# EAGLE design 18650 Battery Tray (EAGLE 9.2.1)
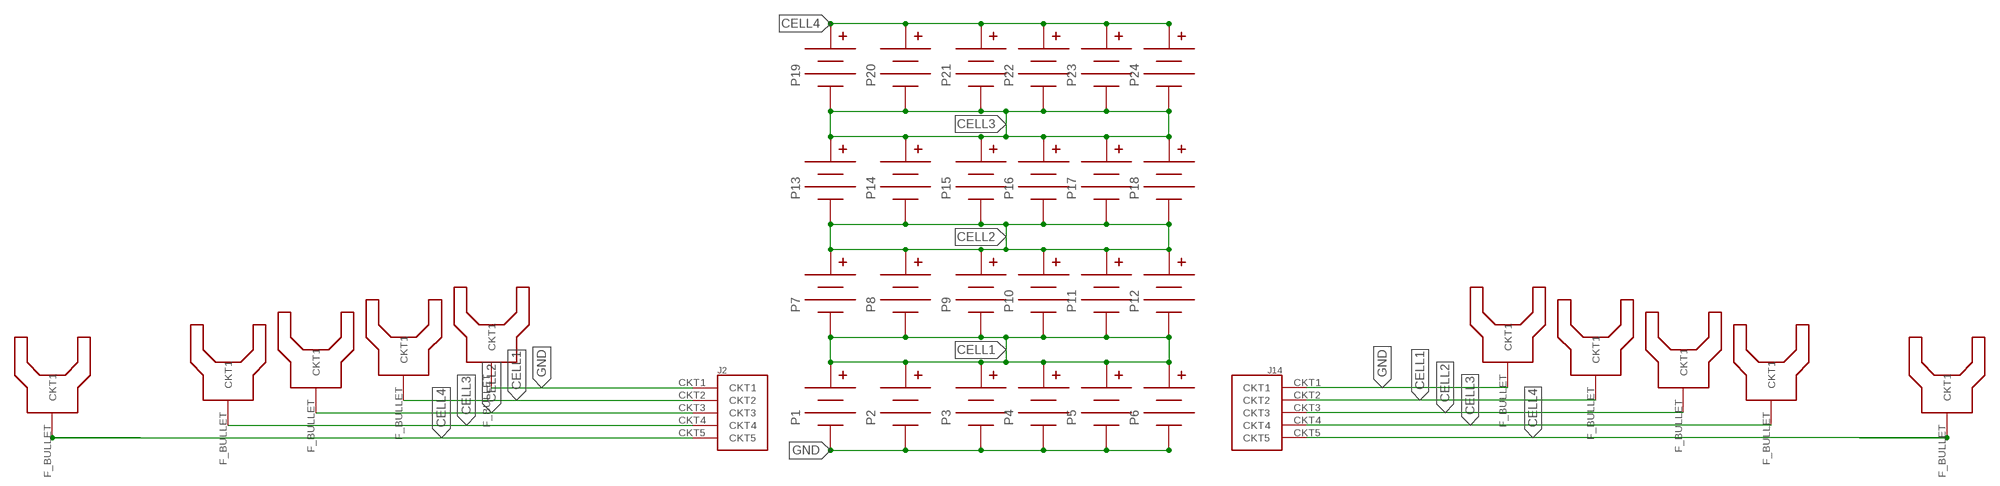
[diagram p0: schematic, sheet 1]

## Parts
J1  FEMALE_BULLET  [FEMALE_BULLET_CONNECTOR_6MM]
J2  MOLEX_NANO_FIT_5CT_VERTICAL_HEADER  [MOLEX_NANO_FIT_5_VERTICAL_HEADER]
J3  FEMALE_BULLET  [FEMALE_BULLET_CONNECTOR_6MM]
J4  FEMALE_BULLET  [FEMALE_BULLET_CONNECTOR_6MM]
J5  FEMALE_BULLET  [FEMALE_BULLET_CONNECTOR_6MM]
J7  FEMALE_BULLET  [FEMALE_BULLET_CONNECTOR_6MM]
J9  FEMALE_BULLET  [FEMALE_BULLET_CONNECTOR_6MM]
J10  FEMALE_BULLET  [FEMALE_BULLET_CONNECTOR_6MM]
J11  FEMALE_BULLET  [FEMALE_BULLET_CONNECTOR_6MM]
J12  FEMALE_BULLET  [FEMALE_BULLET_CONNECTOR_6MM]
J14  MOLEX_NANO_FIT_5CT_VERTICAL_HEADER  [MOLEX_NANO_FIT_5_VERTICAL_HEADER]
J15  FEMALE_BULLET  [FEMALE_BULLET_CONNECTOR_6MM]
P1  18650_BAT_TRAY_SMD_NON_POLAR  [18650_BAT_TRAY_SMD_NON_POLAR]
P2  18650_BAT_TRAY_SMD_NON_POLAR  [18650_BAT_TRAY_SMD_NON_POLAR]
P3  18650_BAT_TRAY_SMD_NON_POLAR  [18650_BAT_TRAY_SMD_NON_POLAR]
P4  18650_BAT_TRAY_SMD_NON_POLAR  [18650_BAT_TRAY_SMD_NON_POLAR]
P5  18650_BAT_TRAY_SMD_NON_POLAR  [18650_BAT_TRAY_SMD_NON_POLAR]
P6  18650_BAT_TRAY_SMD_NON_POLAR  [18650_BAT_TRAY_SMD_NON_POLAR]
P7  18650_BAT_TRAY_SMD_NON_POLAR  [18650_BAT_TRAY_SMD_NON_POLAR]
P8  18650_BAT_TRAY_SMD_NON_POLAR  [18650_BAT_TRAY_SMD_NON_POLAR]
P9  18650_BAT_TRAY_SMD_NON_POLAR  [18650_BAT_TRAY_SMD_NON_POLAR]
P10  18650_BAT_TRAY_SMD_NON_POLAR  [18650_BAT_TRAY_SMD_NON_POLAR]
P11  18650_BAT_TRAY_SMD_NON_POLAR  [18650_BAT_TRAY_SMD_NON_POLAR]
P12  18650_BAT_TRAY_SMD_NON_POLAR  [18650_BAT_TRAY_SMD_NON_POLAR]
P13  18650_BAT_TRAY_SMD_NON_POLAR  [18650_BAT_TRAY_SMD_NON_POLAR]
P14  18650_BAT_TRAY_SMD_NON_POLAR  [18650_BAT_TRAY_SMD_NON_POLAR]
P15  18650_BAT_TRAY_SMD_NON_POLAR  [18650_BAT_TRAY_SMD_NON_POLAR]
P16  18650_BAT_TRAY_SMD_NON_POLAR  [18650_BAT_TRAY_SMD_NON_POLAR]
P17  18650_BAT_TRAY_SMD_NON_POLAR  [18650_BAT_TRAY_SMD_NON_POLAR]
P18  18650_BAT_TRAY_SMD_NON_POLAR  [18650_BAT_TRAY_SMD_NON_POLAR]
P19  18650_BAT_TRAY_SMD_NON_POLAR  [18650_BAT_TRAY_SMD_NON_POLAR]
P20  18650_BAT_TRAY_SMD_NON_POLAR  [18650_BAT_TRAY_SMD_NON_POLAR]
P21  18650_BAT_TRAY_SMD_NON_POLAR  [18650_BAT_TRAY_SMD_NON_POLAR]
P22  18650_BAT_TRAY_SMD_NON_POLAR  [18650_BAT_TRAY_SMD_NON_POLAR]
P23  18650_BAT_TRAY_SMD_NON_POLAR  [18650_BAT_TRAY_SMD_NON_POLAR]
P24  18650_BAT_TRAY_SMD_NON_POLAR  [18650_BAT_TRAY_SMD_NON_POLAR]

## Nets
CELL1: J2.CKT2 J3.F_BULLET(CKT1) J10.F_BULLET(CKT1) J14.CKT2 P1.P$2(V+) P2.P$2(V+) P3.P$2(V+) P4.P$2(V+) P5.P$2(V+) P6.P$2(V+) P7.P$1(V-) P8.P$1(V-) P9.P$1(V-) P10.P$1(V-) P11.P$1(V-) P12.P$1(V-)
CELL2: J2.CKT3 J4.F_BULLET(CKT1) J11.F_BULLET(CKT1) J14.CKT3 P7.P$2(V+) P8.P$2(V+) P9.P$2(V+) P10.P$2(V+) P11.P$2(V+) P12.P$2(V+) P13.P$1(V-) P14.P$1(V-) P15.P$1(V-) P16.P$1(V-) P17.P$1(V-) P18.P$1(V-)
CELL3: J2.CKT4 J5.F_BULLET(CKT1) J12.F_BULLET(CKT1) J14.CKT4 P13.P$2(V+) P14.P$2(V+) P15.P$2(V+) P16.P$2(V+) P17.P$2(V+) P18.P$2(V+) P19.P$1(V-) P20.P$1(V-) P21.P$1(V-) P22.P$1(V-) P23.P$1(V-) P24.P$1(V-)
CELL4: J2.CKT5 J7.F_BULLET(CKT1) J14.CKT5 J15.F_BULLET(CKT1) P19.P$2(V+) P20.P$2(V+) P21.P$2(V+) P22.P$2(V+) P23.P$2(V+) P24.P$2(V+)
GND: J1.F_BULLET(CKT1) J2.CKT1 J9.F_BULLET(CKT1) J14.CKT1 P1.P$1(V-) P2.P$1(V-) P3.P$1(V-) P4.P$1(V-) P5.P$1(V-) P6.P$1(V-)

## Library data of the parts
J1 J3-J5 J7 J9-J12 J15 = Hydronalix:FEMALE_BULLET
J2 J14 = Hydronalix:MOLEX_NANO_FIT_5CT_VERTICAL_HEADER
P1-P24 = Hydronalix:18650_BAT_TRAY_SMD_NON_POLAR

## Board
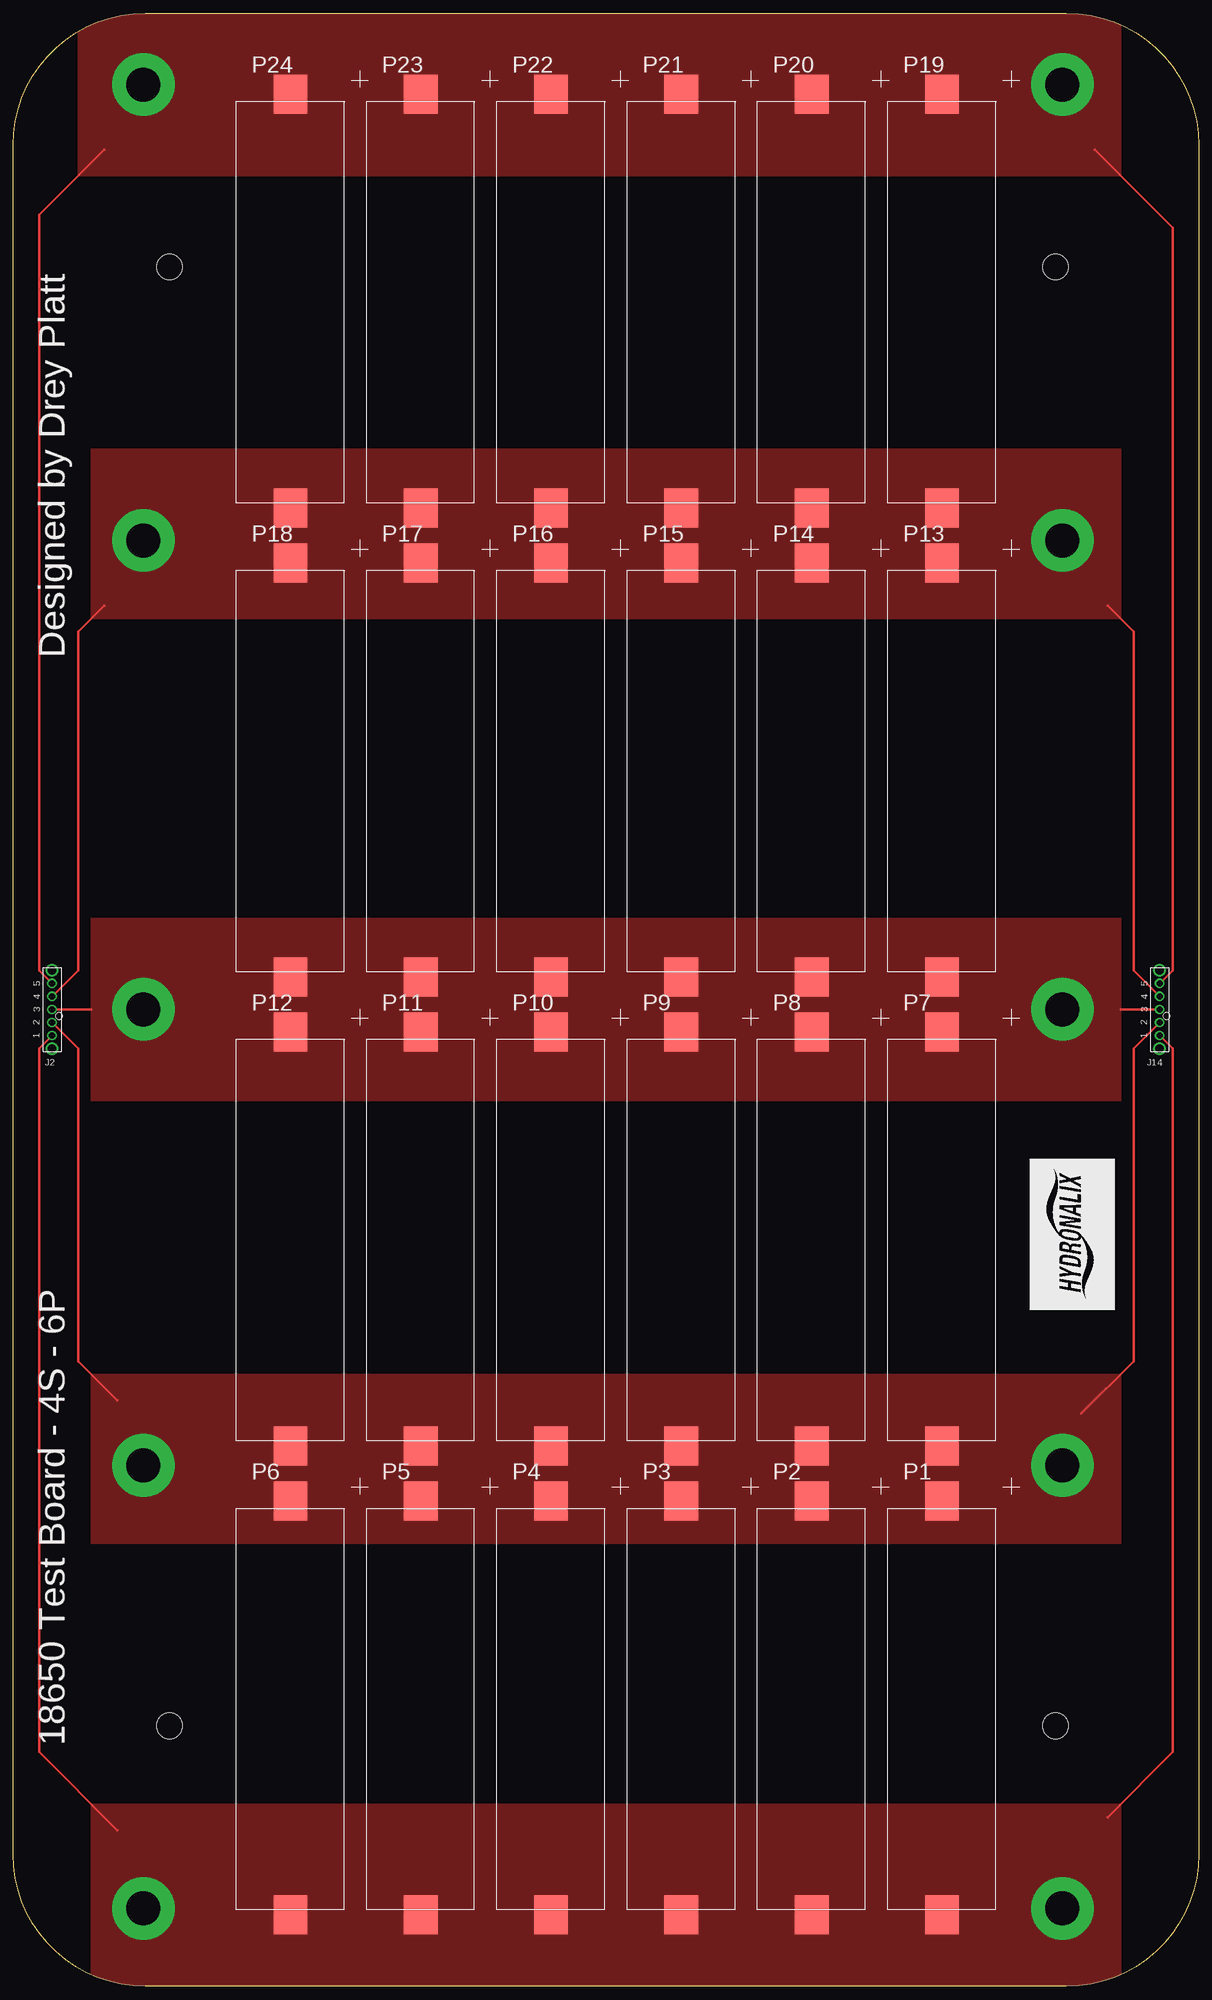
[diagram p1: board, top side]

Size 227.5 x 378.73 mm. Coordinates in mm from the lower left corner, seen from the top.
Outline: 227.5,353.33 227.5,25.4 arc-90 202.1,0 25.4,0 arc-90 0,25.4 0,353.33 arc-90 25.4,378.73 202.1,378.73 arc-90 227.5,353.33
Copper layers (1*16): Top 0.035mm / dielectric 1.5mm / Bottom 0.035mm
Design rules "default *": minimum track width 6mil, minimum drill 0.35mm, track to track 6mil, track to pad 6mil, pad to pad 6mil, via to via 6mil, smd to smd 6mil, copper to edge 6mil, drill to drill 6mil, minimum pad ring 10mil, minimum via ring 8mil, stop-mask expansion 4mil, vias tented up to drill 0mil, thermal gap 0mil
Holes 4.98 mm at 30,50 200,50 200,330 30,330

### Footprints (pad centres in the part's own frame; a part is rotated, then mirrored left to right if it is on the bottom)
FEMALE_BULLET_CONNECTOR_6MM = drill 6.5 pad 12: F_BULLET 0,0
MOLEX_NANO_FIT_5_VERTICAL_HEADER = drill 1.2: CKT1 -5,0; CKT2 -2.5,0; CKT3 0,0; CKT4 2.5,0; CKT5 5,0 | drill 1.6 pad 1.93: CKT6 -7.5,0; CKT7 7.5,0 | hole 1.3: -1.25,-1.34
18650_BAT_TRAY_SMD_NON_POLAR = smd 6.477 x 7.468: P$1 3.226,3.734; P$2 3.226,83.16

### Placement (x,y rotation side)
J1  201.31,15 0 top
J2  7.5,187.5 90 top
J3  25,100 0 top
J4  25,187.5 0 top
J5  25,277.5 0 top
J7  25,365 0 top
J9  25,15 0 top
J10  201.31,100 0 top
J11  201.31,187.5 0 top
J12  201.31,277.5 0 top
J14  220,187.5 90 top
J15  201.31,365 0 bottom
P1  175,10 0 top
P2  150,10 0 top
P3  125,10 0 top
P4  100,10 0 top
P5  75,10 0 top
P6  50,10 0 top
P7  175,100 0 top
P8  150,100 0 top
P9  125,100 0 top
P10  100,100 0 top
P11  75,100 0 top
P12  50,100 0 top
P13  175,190 0 top
P14  150,190 0 top
P15  125,190 0 top
P16  100,190 0 top
P17  75,190 0 top
P18  50,190 0 top
P19  175,280 0 top
P20  150,280 0 top
P21  125,280 0 top
P22  100,280 0 top
P23  75,280 0 top
P24  50,280 0 top

### Tracks (layer width: path | path; a pad name or v marks a point on that pad's centre or on a via)
CELL1
  Top 0.508: J2.CKT2 12.5,180 12.5,120 20,112.5 | J14.CKT2 215,180 215,120 205,110
  pour Top: 15,85 212.5,85 212.5,117.5 15,117.5
CELL2
  Top 0.508: J14.CKT3 212.5,187.5 | J2.CKT3 15,187.5
  pour Top: 15,170 212.5,170 212.5,205 15,205
CELL3
  Top 0.508: J14.CKT4 215,195 215,260 210,265 | J2.CKT4 12.5,195 12.5,260 17.5,265
  pour Top: 15,262.5 212.5,262.5 212.5,295 15,295
CELL4
  Top 0.508: 207.5,352.5 222.5,337.5 222.5,195 J14.CKT5 | J2.CKT5 5,195 5,340 17.5,352.5
  pour Top: 12.5,347.5 212.5,347.5 212.5,380 12.5,380
GND
  Top 0.508: J2.CKT1 5,180 5,45 20,30 | J14.CKT1 222.5,180 222.5,45 210,32.5
  pour Top: 15,0 212.5,0 212.5,35 15,35

### Text on the board
tPlace: Designed by Drey Platt | 18650 Test Board - 4S - 6P